# EAGLE schematic star (EAGLE 9.6.2)
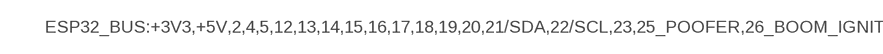
[diagram p0: schematic, sheet 1, part 1 of 2]
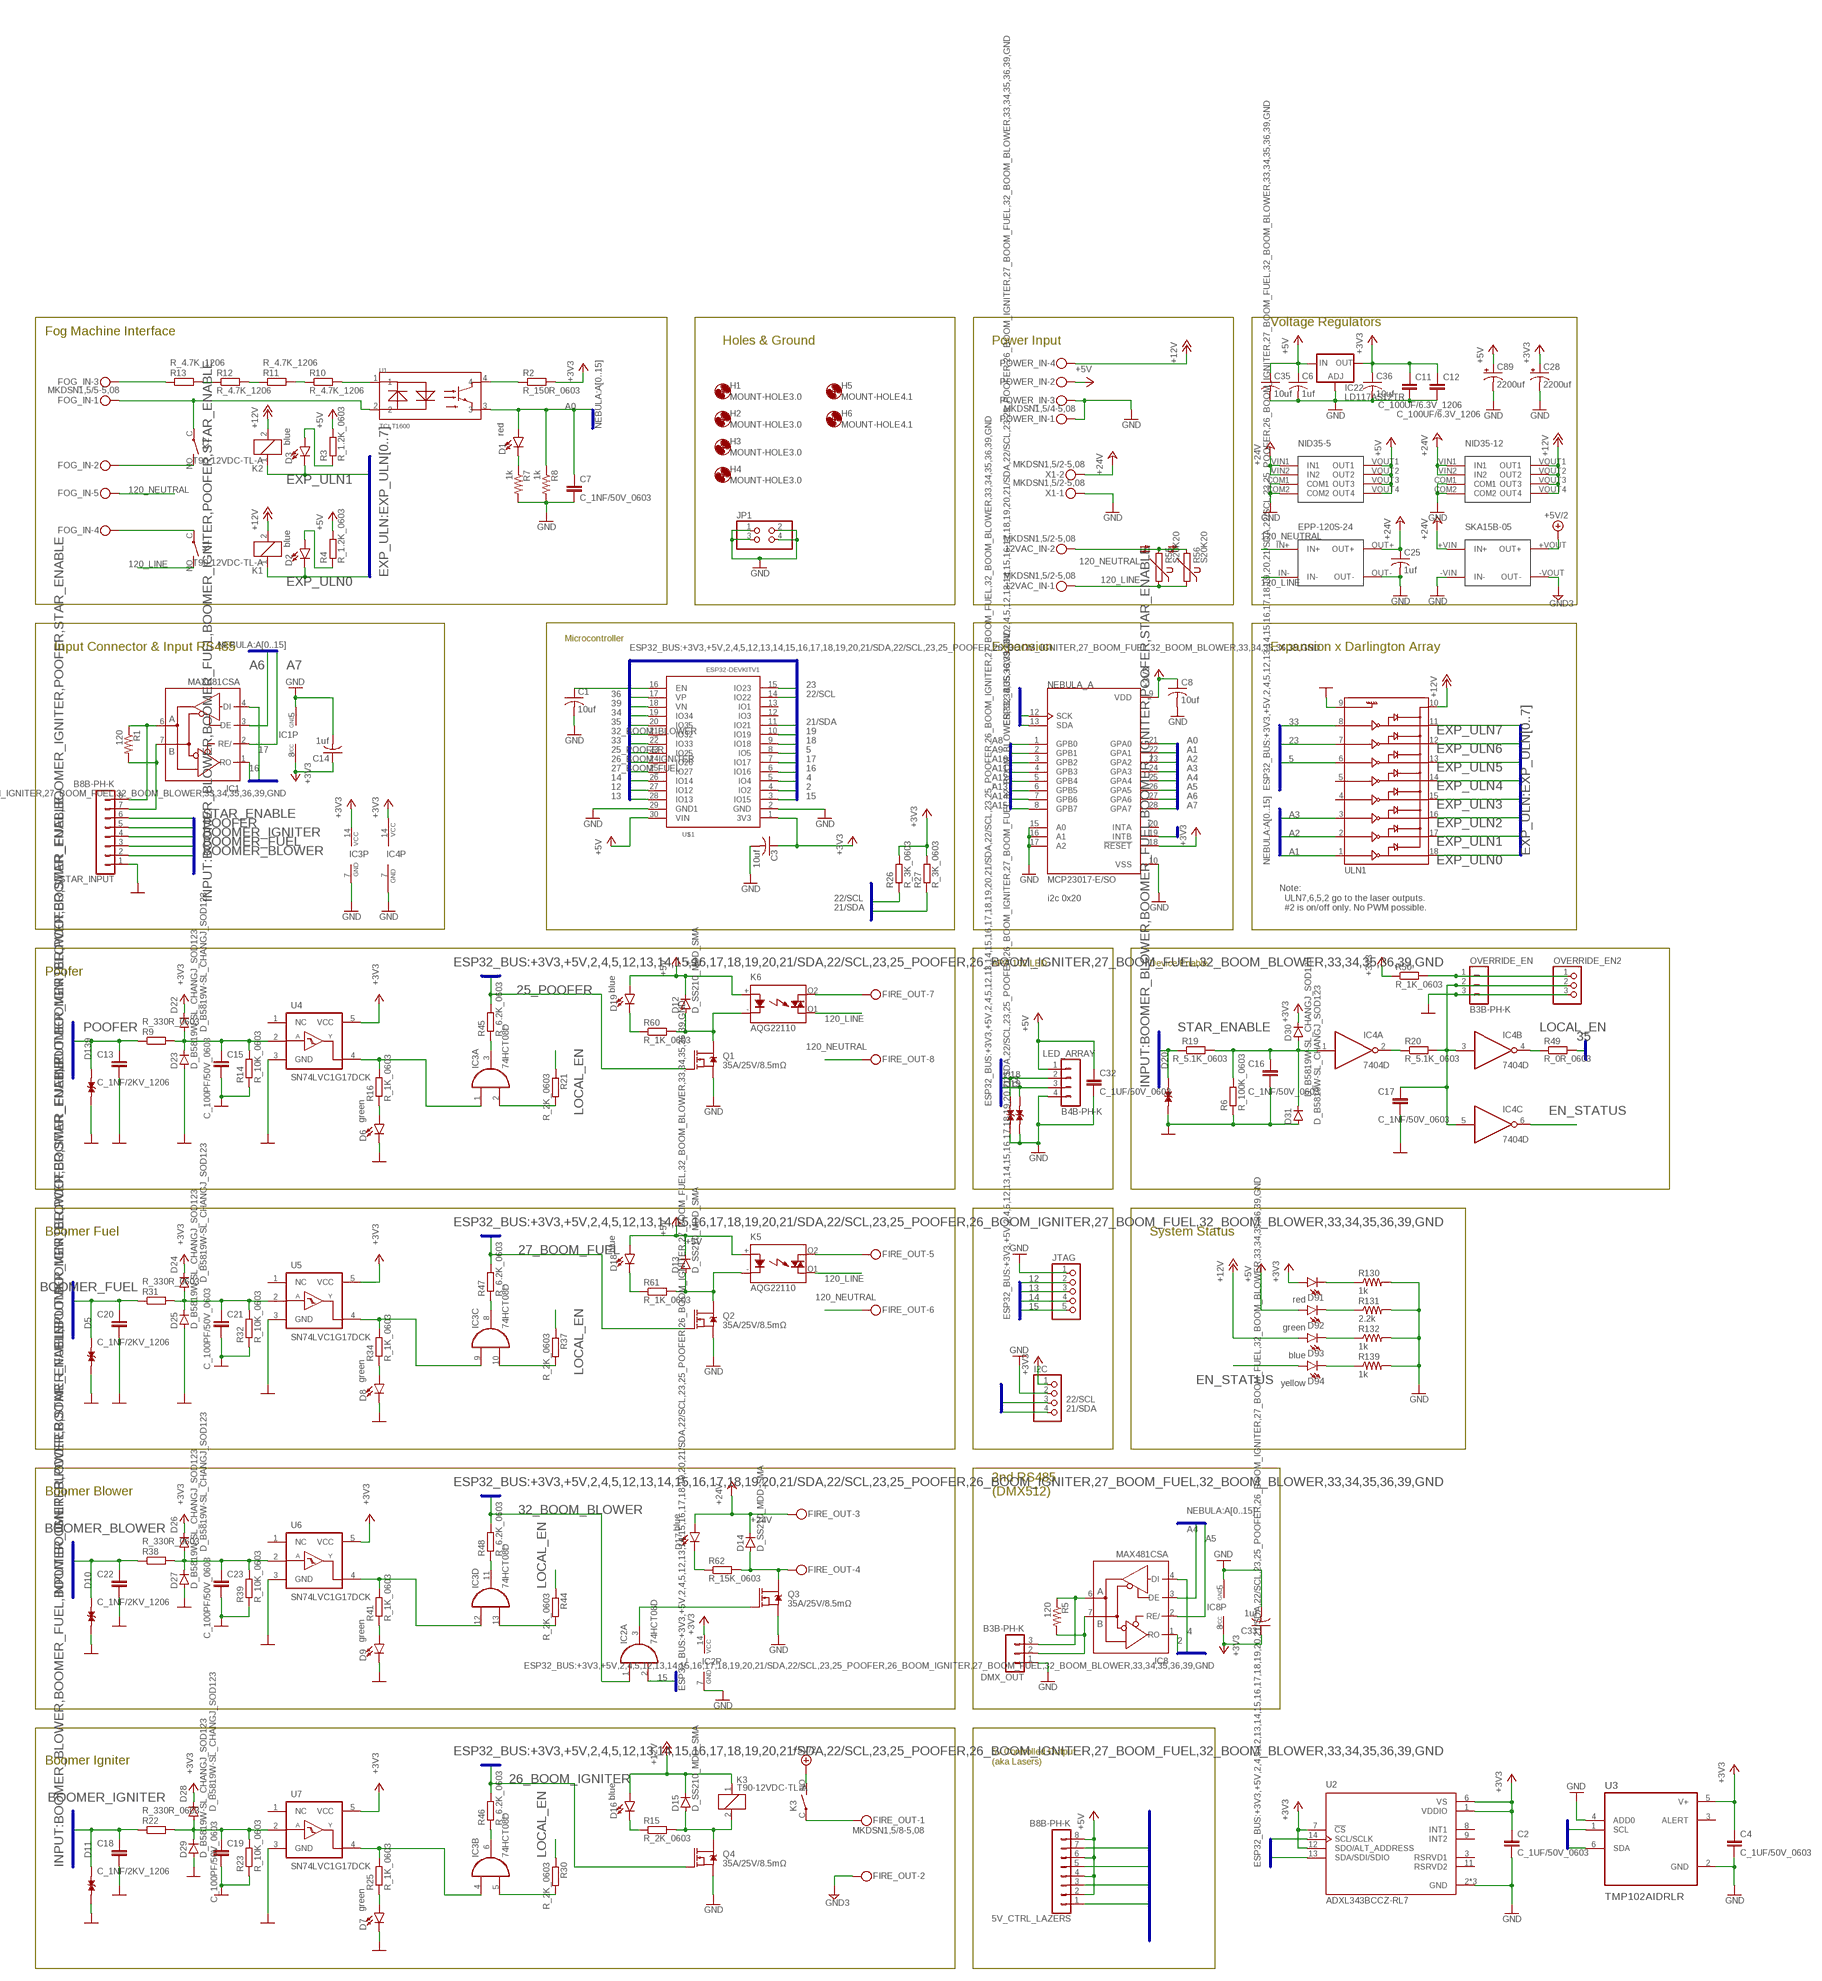
[diagram p1: schematic, sheet 1, part 2 of 2]

## Parts
5V_CTRL_LAZERS  B8B-PH-K  [B8B-PH-K]
12VAC_IN  MKDSN1,5/2-5,08  [MKDSN1,5/2-5,08]
C1  10uf  C-USC0603  [C0603]
C2  C_1UF/50V_0603  [C0603]
C3  10uf  C-USC0603  [C0603]
C4  C_1UF/50V_0603  [C0603]
C6  1uf  C-USC0805  [C0805]
C7  C_1NF/50V_0603  [C0603]
C8  10uf  C-USC0603  [C0603]
C11  C_100UF/6.3V_1206  [C1206]
C12  C_100UF/6.3V_1206  [C1206]
C13  C_1NF/2KV_1206  [C1206]
C14  1uf  C-USC0805  [C0805]
C15  C_100PF/50V_0603  [C0603]
C16  C_1NF/50V_0603  [C0603]
C17  C_1NF/50V_0603  [C0603]
C18  C_1NF/2KV_1206  [C1206]
C19  C_100PF/50V_0603  [C0603]
C20  C_1NF/2KV_1206  [C1206]
C21  C_100PF/50V_0603  [C0603]
C22  C_1NF/2KV_1206  [C1206]
C23  C_100PF/50V_0603  [C0603]
C25  1uf  C-USC0805  [C0805]
C28  2200uf  CPOL-USE5-13  [E5-13]
C32  C_1UF/50V_0603  [C0603]
C33  1uf  C-USC0805  [C0805]
C35  10uf  C-USC0603  [C0603]
C36  10uf  C-USC0603  [C0603]
C89  2200uf  CPOL-USE5-13  [E5-13]
D1  red  LED0603  [LED-0603]
D2  blue  LED0603  [LED-0603]
D3  blue  LED0603  [LED-0603]
D4  SMBJ8.0CA  [DIOM4336X265N]
D5  SMBJ8.0CA  [DIOM4336X265N]
D6  green  LED0603  [LED-0603]
D7  green  LED0603  [LED-0603]
D8  green  LED0603  [LED-0603]
D9  green  LED0603  [LED-0603]
D10  SMBJ8.0CA  [DIOM4336X265N]
D11  SMBJ8.0CA  [DIOM4336X265N]
D12  D_SS210_MDD_SMA  [DO-214AC]
D13  D_SS210_MDD_SMA  [DO-214AC]
D14  D_SS210_MDD_SMA  [DO-214AC]
D15  D_SS210_MDD_SMA  [DO-214AC]
D16  blue  LED0603  [LED-0603]
D17  blue  LED0603  [LED-0603]
D18  blue  LED0603  [LED-0603]
D19  blue  LED0603  [LED-0603]
D20  SMBJ8.0CA  [DIOM4336X265N]
D21  SMBJ8.0CA  [DIOM4336X265N]
D22  D_B5819W-SL_CHANGJ_SOD123  [SOD123]
D23  D_B5819W-SL_CHANGJ_SOD123  [SOD123]
D24  D_B5819W-SL_CHANGJ_SOD123  [SOD123]
D25  D_B5819W-SL_CHANGJ_SOD123  [SOD123]
D26  D_B5819W-SL_CHANGJ_SOD123  [SOD123]
D27  D_B5819W-SL_CHANGJ_SOD123  [SOD123]
D28  D_B5819W-SL_CHANGJ_SOD123  [SOD123]
D29  D_B5819W-SL_CHANGJ_SOD123  [SOD123]
D30  D_B5819W-SL_CHANGJ_SOD123  [SOD123]
D31  D_B5819W-SL_CHANGJ_SOD123  [SOD123]
D91  red  LED0603  [LED-0603]
D92  green  LED0603  [LED-0603]
D93  blue  LED0603  [LED-0603]
D94  yellow  LED0603  [LED-0603]
D139  SMBJ8.0CA  [DIOM4336X265N]
DMX_OUT  B3B-PH-K  [B3B-PH-K]
EPP-120S-24  EPP-120S  [EPS-25]
FIRE_OUT  MKDSN1,5/8-5,08  [MKDSN1,5/8-5,08]
FOG_IN  MKDSN1,5/5-5,08  [MKDSN1,5/5-5,08]
H1  MOUNT-HOLE3.0  [3,0]
H2  MOUNT-HOLE3.0  [3,0]
H3  MOUNT-HOLE3.0  [3,0]
H4  MOUNT-HOLE3.0  [3,0]
H5  MOUNT-HOLE4.1  [4,1]
H6  MOUNT-HOLE4.1  [4,1]
I2C  PINHD-1X4  [1X04]
IC1  MAX481CSA  [SO08]
IC2  74HCT08D  [SO14]
IC3  74HCT08D  [SO14]
IC4  7404D  [SO14]
IC8  MAX481CSA  [SO08]
IC22  LD117AS12TR  [SOT223]
JP1  PINHD-2X2  [2X02]
JTAG  PINHD-1X5  [1X05]
K1  T90-12VDC-TL-A  JT1A-PCB-DC12V  [JT1A-PCB]
K2  T90-12VDC-TL-A  JT1A-PCB-DC12V  [JT1A-PCB]
K3  T90-12VDC-TL-A  JT1A-PCB-DC12V  [JT1A-PCB]
K5  AQG22110  [AQG]
K6  AQG22110  [AQG]
LED_ARRAY  B4B-PH-K  [B4B-PH-K]
NEBULA_A  MCP23017-E/SO  [SOIC127P1030X265-28N]
NID35-5  NID35  [NID35]
NID35-12  NID35  [NID35]
OVERRIDE_EN  B3B-PH-K  [B3B-PH-K]
OVERRIDE_EN2  PINHD-1X3  [1X03]
POWER_IN  MKDSN1,5/4-5,08  [MKDSN1,5/4-5,08]
Q1  35A/25V/8.5mΩ  MOSFET-NCH-FDD8780  [DPAK]
Q2  35A/25V/8.5mΩ  MOSFET-NCH-FDD8780  [DPAK]
Q3  35A/25V/8.5mΩ  MOSFET-NCH-FDD8780  [DPAK]
Q4  35A/25V/8.5mΩ  MOSFET-NCH-FDD8780  [DPAK]
R1  120  R-US_R0603  [R0603]
R2  R_150R_0603  [R0603]
R3  R_1.2K_0603  [R0603]
R4  R_1.2K_0603  [R0603]
R5  120  R-US_R0603  [R0603]
R6  R_100K_0603  [R0603]
R7  1k  R-US_R0603  [R0603]
R8  1k  R-US_R0603  [R0603]
R9  R_330R_0603  [R0603]
R10  R_4.7K_1206  [R1206]
R11  R_4.7K_1206  [R1206]
R12  R_4.7K_1206  [R1206]
R13  R_4.7K_1206  [R1206]
R14  R_10K_0603  [R0603]
R15  R_2K_0603  [R0603]
R16  R_1K_0603  [R0603]
R19  R_5.1K_0603  [R0603]
R20  R_5.1K_0603  [R0603]
R21  R_2K_0603  [R0603]
R22  R_330R_0603  [R0603]
R23  R_10K_0603  [R0603]
R25  R_1K_0603  [R0603]
R26  R_3K_0603  [R0603]
R27  R_3K_0603  [R0603]
R30  R_2K_0603  [R0603]
R31  R_330R_0603  [R0603]
R32  R_10K_0603  [R0603]
R34  R_1K_0603  [R0603]
R37  R_2K_0603  [R0603]
R38  R_330R_0603  [R0603]
R39  R_10K_0603  [R0603]
R41  R_1K_0603  [R0603]
R44  R_2K_0603  [R0603]
R45  R_6.2K_0603  [R0603]
R46  R_6.2K_0603  [R0603]
R47  R_6.2K_0603  [R0603]
R48  R_6.2K_0603  [R0603]
R49  R_0R_0603  [R0603]
R50  R_1K_0603  [R0603]
R55  S20K20  [S20K20]
R56  S20K20  [S20K20]
R60  R_1K_0603  [R0603]
R61  R_1K_0603  [R0603]
R62  R_15K_0603  [R0603]
R130  1k  R-US_R0603  [R0603]
R131  2.2k  R-US_R0603  [R0603]
R132  1k  R-US_R0603  [R0603]
R139  1k  R-US_R0603  [R0603]
SKA15B-05  SKA15B  [SKA15B]
STAR_INPUT  B8B-PH-K  [B8B-PH-K]
U1  TCLT1600  [SOP254P1015X230-4N]
U2  ADXL343BCCZ-RL7  [PQFN80P300X500X100-14N]
U3  TMP102AIDRLR  [SOT50P160X60-6N]
U4  SN74LVC1G17DCK  [SC70-5]
U5  SN74LVC1G17DCK  [SC70-5]
U6  SN74LVC1G17DCK  [SC70-5]
U7  SN74LVC1G17DCK  [SC70-5]
U$1  ESP32DEVKITV1  [ESP32-DEVKITV1]
ULN1  ULN2803SOICW  [SO18L]
X1  MKDSN1,5/2-5,08  [MKDSN1,5/2-5,08]

## Nets
2: IC8.1(RO) U$1.4(IO2)
4: IC8.4(DI) U$1.5(IO4)
5: U$1.8(IO5) ULN1.6
12: JTAG.2 U$1.27(IO12)
13 [3V3]: JTAG.3 U$1.28(IO13)
14: JTAG.4 U$1.26(IO14)
15: IC2.2(A:I1) JTAG.5 U$1.3(IO15)
16: IC1.1(RO) U$1.6(IO16)
17: IC1.4(DI) U$1.7(IO17)
18: D21.2 LED_ARRAY.2 U$1.9(IO18)
19: D4.2 LED_ARRAY.3 U$1.10(IO19)
21/SDA: I2C.4 NEBULA_A.13(SDA) R27.1 U2.13(SDA/SDI/SDIO) U3.6(SDA) U$1.11(IO21)
22/SCL: I2C.3 NEBULA_A.12(SCK) R26.1 U2.14(SCL/SCLK) U3.1(SCL) U$1.14(IO22)
23: U$1.15(IO23) ULN1.7
25_POOFER: Q1.1(G) R45.2 U$1.23(IO25)
26_BOOM_IGNITER: Q4.1(G) R46.2 U$1.24(IO26)
27_BOOM_FUEL: Q2.1(G) R47.2 U$1.25(IO27)
32_BOOM_BLOWER: IC2.1(A:I0) R48.2 U$1.21(IO32)
33: U$1.22(IO33) ULN1.8
34: NEBULA_A.19(INTB) U$1.19(IO34)
35: R49.2 U$1.20(IO35)
36: U$1.17(VP)
39: U$1.18(VN)
120_LINE [120VAC_PWR]: 12VAC_IN.1 EPP-120S-24.IN- K1.NO(S) K5.O1(DS2) K6.O1(DS2) R55.1 R56.1
120_NEUTRAL [120VAC_PWR]: 12VAC_IN.2 EPP-120S-24.IN+ FIRE_OUT.6 FIRE_OUT.8 FOG_IN.5 R55.2 R56.2
+3V3 [3V3]: C2.1 C3.1 C4.1 C8.1 C11.1 C12.1 C14.1 C28.+ C33.1 C36.1 D22.C D24.C D26.C D28.C D30.C D91.A I2C.1 IC1.8(VCC) IC2.14(P:VCC) IC3.14(P:VCC) IC4.14(P:VCC) IC8.8(VCC) IC22.4(OUT) NEBULA_A.9(VDD) NEBULA_A.18(!RESET) R2.2 R26.2 R27.2 R50.1 U2.1(VDDIO) U2.6(VS) U2.7(!CS) U2.12(SDO/ALT_ADDRESS) U3.5(V+) U4.5(VCC) U5.5(VCC) U6.5(VCC) U7.5(VCC) U$1.1(3V3)
+5V [5V]: 5V_CTRL_LAZERS.2 5V_CTRL_LAZERS.4 5V_CTRL_LAZERS.6 5V_CTRL_LAZERS.8 C6.1 C32.1 C35.1 C89.+ D12.C D13.C D18.A D19.A D92.A IC22.3(IN) K5.+(A) K6.+(A) LED_ARRAY.1 NID35-5.VOUT1(OUT1) NID35-5.VOUT2(OUT2) NID35-5.VOUT3(OUT3) NID35-5.VOUT4(OUT4) POWER_IN.2 R3.2 R4.2 U$1.30(VIN)
+5V/2: K3.NO(S) SKA15B-05.+VOUT(OUT+)
+12V [12V]: D15.C D16.A D93.A K1.2 K2.2 K3.1 NID35-12.VOUT1(OUT1) NID35-12.VOUT2(OUT2) NID35-12.VOUT3(OUT3) NID35-12.VOUT4(OUT4) POWER_IN.4 ULN1.10
+24V: C25.1 D14.C D17.A EPP-120S-24.OUT+ FIRE_OUT.3 NID35-5.VIN1(IN1) NID35-5.VIN2(IN2) NID35-12.VIN1(IN1) NID35-12.VIN2(IN2) SKA15B-05.+VIN(IN+) X1.2
A0: C7.1 D1.A NEBULA_A.21(GPA0) R8.1 U1.3
A1: NEBULA_A.22(GPA1) ULN1.1
A2: NEBULA_A.23(GPA2) ULN1.2
A3: NEBULA_A.24(GPA3) ULN1.3
A4: IC8.3(DE) NEBULA_A.25(GPA4)
A5: IC8.2(RE/) NEBULA_A.26(GPA5)
A6: IC1.3(DE) NEBULA_A.27(GPA6)
A7: IC1.2(RE/) NEBULA_A.28(GPA7)
A8: NEBULA_A.1(GPB0)
A9: NEBULA_A.2(GPB1)
A10: NEBULA_A.3(GPB2)
A11: NEBULA_A.4(GPB3)
A12: NEBULA_A.5(GPB4)
A13: NEBULA_A.6(GPB5)
A14: NEBULA_A.7(GPB6)
A15: NEBULA_A.8(GPB7)
BOOMER_BLOWER: C22.1 D10.2 R38.1 STAR_INPUT.2
BOOMER_FUEL: C20.1 D5.2 R31.1 STAR_INPUT.3
BOOMER_IGNITER: C18.1 D11.2 R22.1 STAR_INPUT.4
EN_STATUS: D94.A IC4.6(C:O)
EXP_ULN0: D2.C K1.1 ULN1.18
EXP_ULN1: D3.C K2.1 ULN1.17
EXP_ULN2: 5V_CTRL_LAZERS.7 ULN1.16
EXP_ULN3: ULN1.15
EXP_ULN4: ULN1.14
EXP_ULN5: 5V_CTRL_LAZERS.5 ULN1.13
EXP_ULN6: 5V_CTRL_LAZERS.3 ULN1.12
EXP_ULN7: 5V_CTRL_LAZERS.1 ULN1.11
GND [GND]: C1.2 C2.2 C3.2 C4.2 C6.2 C7.2 C8.2 C11.2 C12.2 C13.2 C14.2 C15.2 C16.2 C17.2 C18.2 C19.2 C20.2 C21.2 C22.2 C23.2 C25.2 C28.- C32.2 C33.2 C35.2 C36.2 C89.- D4.1 D5.1 D6.C D7.C D8.C D9.C D10.1 D11.1 D20.1 D21.1 D23.A D25.A D27.A D29.A D31.A D139.1 DMX_OUT.1 EPP-120S-24.OUT- I2C.2 IC1.5(GND) IC2.7(P:GND) IC3.7(P:GND) IC4.7(P:GND) IC8.5(GND) IC22.1(ADJ) JP1.1 JP1.2 JP1.3 JP1.4 JTAG.1 LED_ARRAY.4 NEBULA_A.10(VSS) NEBULA_A.15(A0) NEBULA_A.16(A1) NEBULA_A.17(A2) NID35-5.COM1 NID35-5.COM2 NID35-12.COM1 NID35-12.COM2 OVERRIDE_EN2.3 OVERRIDE_EN.3 POWER_IN.1 POWER_IN.3 Q1.3(S) Q2.3(S) Q3.3(S) Q4.3(S) R6.1 R7.2 R8.2 R14.1 R23.1 R32.1 R39.1 R130.2 R131.2 R132.2 R139.2 SKA15B-05.-VIN(IN-) STAR_INPUT.1 U2.2(GND) U2.4(GND) U2.5(GND) U3.2(GND) U3.4(ADD0) U4.3(GND) U5.3(GND) U6.3(GND) U7.3(GND) U$1.2(GND) U$1.29(GND1) ULN1.9 X1.1
GND3 [GND]: FIRE_OUT.2 SKA15B-05.-VOUT(OUT-)
LOCAL_EN: IC4.4(B:O) R21.1 R30.1 R37.1 R44.1 R49.1
N$1: C1.1 U$1.16(EN)
N$2: R2.1 U1.4
N$3: D2.A R4.1
N$4: D3.A R3.1
N$5: DMX_OUT.2 IC8.7(B) R5.2
N$6: DMX_OUT.3 IC8.6(A) R5.1
N$7 [120VAC]: FOG_IN.3 R13.1
N$8 [120VAC]: R12.1 R13.2
N$9 [120VAC]: R11.1 R12.2
N$10 [120VAC]: R10.1 R11.2
N$11 [120VAC]: R10.2 U1.1
N$12: D1.C R7.1
N$13 [120VAC]: FOG_IN.2 K2.NO(S)
N$14 [120VAC_PWR]: FOG_IN.4 K1.C(P)
N$15 [120VAC]: FOG_IN.1 K2.C(P) U1.2
N$16: IC3.1(A:I0) R16.2 U4.4(Y)
N$17: C15.1 D22.A D23.C R9.2 R14.2 U4.2(A)
N$18: D6.A R16.1
N$21: IC4.2(A:O) R20.1
N$22: C17.1 IC4.3(B:I) IC4.5(C:I) OVERRIDE_EN2.2 OVERRIDE_EN.2 R20.2
N$23: C16.1 D30.A D31.C IC4.1(A:I) R6.2 R19.2
N$24: IC3.2(A:I1) R21.2
N$25: C19.1 D28.A D29.C R22.2 R23.2 U7.2(A)
N$26: IC3.4(B:I0) R25.2 U7.4(Y)
N$27: D7.A R25.1
N$30: IC3.5(B:I1) R30.2
N$31: C21.1 D24.A D25.C R31.2 R32.2 U5.2(A)
N$32: IC3.9(C:I0) R34.2 U5.4(Y)
N$33: D8.A R34.1
N$36: IC3.10(C:I1) R37.2
N$37: C23.1 D26.A D27.C R38.2 R39.2 U6.2(A)
N$38: IC3.12(D:I0) R41.2 U6.4(Y)
N$39: D9.A R41.1
N$42: IC3.13(D:I1) R44.2
N$43: IC3.3(A:O) R45.1
N$44: IC3.6(B:O) R46.1
N$45: IC3.8(C:O) R47.1
N$46: IC3.11(D:O) R48.1
N$47: D13.A K5.-(K) Q2.4(D) R61.2
N$48: FIRE_OUT.7 K6.O2(DS1)
N$49: D12.A K6.-(K) Q1.4(D) R60.2
N$50: FIRE_OUT.5 K5.O2(DS1)
N$51: D14.A FIRE_OUT.4 Q3.4(D) R62.2
N$52: D15.A K3.2 Q4.4(D) R15.2
N$53: FIRE_OUT.1 K3.C(P)
N$54: D16.C R15.1
N$55: D17.C R62.1
N$56: D18.C R61.1
N$57: D19.C R60.1
N$58: OVERRIDE_EN2.1 OVERRIDE_EN.1 R50.2
N$60: IC2.3(A:O) Q3.1(G)
N$108: IC1.7(B) R1.2 STAR_INPUT.7
N$109: IC1.6(A) R1.1 STAR_INPUT.8
N$156: D91.C R130.1
N$157: D92.C R131.1
N$158: D93.C R132.1
N$159: D94.C R139.1
POOFER: C13.1 D139.2 R9.1 STAR_INPUT.5
STAR_ENABLE: D20.2 R19.1 STAR_INPUT.6
Unconnected: IC2.4(B:I0) IC2.5(B:I1) IC2.6(B:O) IC2.8(C:O) IC2.9(C:I0) IC2.10(C:I1) IC2.11(D:O) IC2.12(D:I0) IC2.13(D:I1) IC4.8(D:O) IC4.9(D:I) IC4.10(E:O) IC4.11(E:I) IC4.12(F:O) IC4.13(F:I) NEBULA_A.20(INTA) U2.3(RSRVD1) U2.8(INT1) U2.9(INT2) U2.11(RSRVD2) U3.3(ALERT) U4.1(NC) U5.1(NC) U6.1(NC) U7.1(NC) U$1.12(IO3) U$1.13(IO1) ULN1.4 ULN1.5

## Buses
ESP32_BUS:+3V3,+5V,2,4,5,12,13,14,15,16,17,18,19,20,21/SDA,22/SCL,23,25_POOFER,26_BOOM_IGNITER,27_BOOM_FUEL,32_BOOM_BLOWER,33,34,35,36,39,GND
NEBULA:A[0..15]
EXP_ULN:EXP_ULN[0..7]
INPUT:BOOMER_BLOWER,BOOMER_FUEL,BOOMER_IGNITER,POOFER,STAR_ENABLE

## Notes on the sheet
- Voltage Regulators
- Fog Machine Interface
- Holes & Ground | Power Input
- Microcontroller
- Input Connector & Input RS485 | Expansion | Expansion x Darlington Array
- i2c 0x20
- Note:
    ULN7,6,5,2 go to the laser outputs.
    #2 is on/off only. No PWM possible.
- APA 102 LED | Device Enable
- Poofer
- Boomer Fuel | System Status
- Boomer Blower
- 2nd RS485
  (DMX512)
- Boomer Igniter
- 5v Controlled Output
  (aka Lasers)

## Library data of the parts
5V_CTRL_LAZERS STAR_INPUT = con-jst-ph:B8B-PH-K: HEADER
12VAC_IN X1 = con-phoenix-508-jm:MKDSN1,5/2-5,08: MKDSN 1,5/ 2-5,08 Printklemme Nennstrom: 13,5 A Nennspannung: 250 V Rastermaß: 5,08 mm Polzahl: 2 Anschlussart: Schraubanschluss Montage: Löten Anschlussrichtung Leiter/Platine: 0 ° Artikelnummer: 1729128 Source: http://eshop.phoenixcontact.com .. 1729128.pdf
C1 C3 C8 C35 C36 = rcl:C-US: CAPACITOR, American symbol; LCSC_PART: C19702; SPICEPREFIX: C
C2 C4 C32 = JLC PCB Basic Parts_loc:C_: Capacitor General purpose SMD Capacitor; LCSC_DATASHEET: https://datasheet.lcsc.com/lcsc/1810261812_Samsung-Electro-Mechanics-CL10A105KB8NNNC_C15849.pdf; LCSC_PART: C15849; LCSC_ROTATION_CCW: 0; LCSC_STOCK: 14650365; PROPERTIES: 50V 1uF X5R ±10% 0603 ROHS
C6 C14 C25 C33 = rcl:C-US: CAPACITOR, American symbol; LCSC_PART: C15849; SPICEPREFIX: C
C7 C16 C17 = JLC PCB Basic Parts_loc:C_: Capacitor General purpose SMD Capacitor; LCSC_DATASHEET: https://datasheet.lcsc.com/lcsc/1811071810_Samsung-Electro-Mechanics-CL10B102KB8NNNC_C1588.pdf; LCSC_PART: C1588; LCSC_ROTATION_CCW: 0; LCSC_STOCK: 2243141; PROPERTIES: 50V 1nF X7R ±10% 0603 ROHS
C11 C12 = JLC PCB Basic Parts_loc:C_: Capacitor General purpose SMD Capacitor; LCSC_DATASHEET: https://datasheet.lcsc.com/lcsc/1810301816_Samsung-Electro-Mechanics-CL31A107MQHNNNE_C15008.pdf; LCSC_PART: C15008; LCSC_ROTATION_CCW: 0; LCSC_STOCK: 547696; PROPERTIES: 6.3V 100uF X5R ±20% 1206 ROHS
C13 C18 C20 C22 = JLC PCB Basic Parts_loc:C_: Capacitor General purpose SMD Capacitor; LCSC_DATASHEET: https://datasheet.lcsc.com/lcsc/1810311314_FH-Guangdong-Fenghua-Advanced-Tech-1206B102K202NT_C9196.pdf; LCSC_PART: C9196; LCSC_ROTATION_CCW: 0; LCSC_STOCK: 8943689; PROPERTIES: 2kV 1nF X7R ±10% 1206 ROHS
C15 C19 C21 C23 = JLC PCB Basic Parts_loc:C_: Capacitor General purpose SMD Capacitor; LCSC_DATASHEET: https://datasheet.lcsc.com/lcsc/1811151136_Samsung-Electro-Mechanics-CL10C101JB8NNNC_C14858.pdf; LCSC_PART: C14858; LCSC_ROTATION_CCW: 0; LCSC_STOCK: 2152181; PROPERTIES: 50V 100pF C0G ±5% 0603 ROHS
C28 C89 = rcl:CPOL-US: POLARIZED CAPACITOR, American symbol; DIST: https://amzn.to/3iR84VS; SPICEPREFIX: C
D1 D91 = SparkFun-LED:LED: LED (Generic) Standard schematic elements and footprints for 5mm, 3mm, 1206, and 0603 sized LEDs. Generic LEDs with no color specified.; JLC_ROTATION: 180; LCSC_PART: C2286
D2 D3 D16-D19 D93 = SparkFun-LED:LED: LED (Generic) Standard schematic elements and footprints for 5mm, 3mm, 1206, and 0603 sized LEDs. Generic LEDs with no color specified.; JLC_ROTATION: 180; LCSC_PART: C72041
D4 D5 D10 D11 D20 D21 D139 = SMBJ8.0CA:SMBJ8.0CA: Check availability <https://pricing.snapeda.com/parts/SMBJ8.0CA/Littelfuse%20Inc./view-part?ref=eda>; AVAILABILITY: In Stock; DESCRIPTION: 600 Watt TVS 5.0v working, 9v clamp; LCSC_PART: C78757; MF: Littelfuse Inc.; MP: SMBJ8.0CA; PACKAGE: DO-214 Littelfuse Inc.; PRICE: None; PURCHASE-URL: https://pricing.snapeda.com/search/part/SMBJ8.0CA/?ref=eda
D6-D9 D92 = SparkFun-LED:LED: LED (Generic) Standard schematic elements and footprints for 5mm, 3mm, 1206, and 0603 sized LEDs. Generic LEDs with no color specified.; JLC_ROTATION: 180; LCSC_PART: C72043
D12-D15 = JLC PCB Basic Parts_loc:D_: Diode; LCSC_DATASHEET: https://datasheet.lcsc.com/lcsc/1811071613_MDD-Microdiode-Electronics--SS210_C14996.pdf; LCSC_PART: C14996; LCSC_ROTATION_CCW: 180; LCSC_STOCK: 307807; PROPERTIES: 100V 850mV@2A 2A SMA(DO-214AC) Schottky Barrier Diodes (SBD) ROHS
D22-D31 = JLC PCB Basic Parts_loc:D_: Diode; LCSC_DATASHEET: https://datasheet.lcsc.com/lcsc/1809140216_Changjiang-Electronics-Tech--CJ-B5819W-SL_C8598.pdf; LCSC_PART: C8598; LCSC_ROTATION_CCW: 180; LCSC_STOCK: 304161; PROPERTIES: 40V 600mV@1A 1A SOD-123 Schottky Barrier Diodes (SBD) ROHS
D94 = SparkFun-LED:LED: LED (Generic) Standard schematic elements and footprints for 5mm, 3mm, 1206, and 0603 sized LEDs. Generic LEDs with no color specified.; JLC_ROTATION: 180; LCSC_PART: C72038
DMX_OUT OVERRIDE_EN = con-jst-ph:B3B-PH-K: HEADER
EPP-120S-24 = Nova:EPP-120S
FIRE_OUT = con-phoenix-508-jm:MKDSN1,5/8-5,08: MKDSN 1,5/ 8-5,08 Printklemme Nennstrom: 13,5 A Nennspannung: 250 V Rastermaß: 5,08 mm Polzahl: 8 Anschlussart: Schraubanschluss Montage: Löten Anschlussrichtung Leiter/Platine: 0 ° Artikelnummer: 1729186 Source: http://eshop.phoenixcontact.com .. 1729186.pdf
FOG_IN = con-phoenix-508-jm:MKDSN1,5/5-5,08: MKDSN 1,5/ 5-5,08 Printklemme Nennstrom: 13,5 A Nennspannung: 250 V Rastermaß: 5,08 mm Polzahl: 5 Anschlussart: Schraubanschluss Montage: Löten Anschlussrichtung Leiter/Platine: 0 ° Artikelnummer: 1729157 Source: http://eshop.phoenixcontact.com .. 1729157.pdf
H1-H6 = holes:MOUNT-HOLE: MOUNTING HOLE with drill center marker
I2C = pinhead:PINHD-1X4: PIN HEADER
IC1 IC8 = maxim:MAX481CSA: RS485 TRANSEIVER; LCSC_PART: C8963; MF: MAXIM; MPN: MAX481CSA; OC_FARNELL: unknown; OC_NEWARK: 90C3817
IC2 IC3 = 74xx-eu:74*08: Quad 2-input AND gate; LCSC_PART: C5593
IC4 = 74xx-us:74*04: Hex INVERTER; LCSC_PART: C5590
IC22 = v-reg:LD117A?*: Low drop fixed and adjustable positive voltage regulators 1 A Source: http://www.st.com/stonline/products/literature/ds/7194/ld1117axx.pdf; LCSC_PART: C347222; PRICE: 0.5
JP1 = pinhead:PINHD-2X2: PIN HEADER
JTAG = pinhead:PINHD-1X5: PIN HEADER
K1-K3 = relay:JT1A?-*: COMPACT ECONOMICAL 30 AMP. RELAY NAiS Source: http://www.mew-europe.com/.. en_ds_61212_0000.pdf; OC_FARNELL: unknown; OC_NEWARK: unknown
K5 K6 = relay:AQG*: SOLID STATE RELAY NAiS Zero-cross, Non zero-cross Source: http://www.mew-europe.com/.. en_ds_61611_0000.pdf; OC_FARNELL: unknown; OC_NEWARK: unknown
LED_ARRAY = con-jst-ph:B4B-PH-K: HEADER
NEBULA_A = MCP23017-E_SO:MCP23017-E/SO: MCP23017 Series 5.5 V 1.7 MHz SMT 16-Bit I2C I/O Expander - SOIC-28 Check availability <https://pricing.snapeda.com/parts/MCP23017-E/SO/Microchip/view-part?ref=eda>; AVAILABILITY: In Stock; DESCRIPTION: I/O Expander 16 I²C 1.7 MHz 28-SOIC; LCSC_PART: C629440; MF: Microchip; MP: MCP23017-E/SO; PACKAGE: SOIC-28 Microchip; PRICE: None; PURCHASE-URL: https://pricing.snapeda.com/search/part/MCP23017-E/SO/?ref=eda
NID35-5 NID35-12 = Nova:NID35
OVERRIDE_EN2 = pinhead:PINHD-1X3: PIN HEADER
POWER_IN = con-phoenix-508-jm:MKDSN1,5/4-5,08: MKDSN 1,5/ 4-5,08 Printklemme Nennstrom: 13,5 A Nennspannung: 250 V Rastermaß: 5,08 mm Polzahl: 4 Anschlussart: Schraubanschluss Montage: Löten Anschlussrichtung Leiter/Platine: 0 ° Artikelnummer: 1729144 Source: http://eshop.phoenixcontact.com .. 1729144.pdf
Q1-Q4 = SparkFun-DiscreteSemi:MOSFET-NCH: N-channel MOSFETs Voltage controlled devices that allow control of high current outputs. SparkFun Products: SparkFun OpenScale <https://www.sparkfun.com/products/13261> SparkFun Digital Sandbox <https://www.sparkfun.com/products/12651> SparkFun Monster Moto Shield <https://www.sparkfun.com/products/10182> SparkFun MOSFET Power Controller <https://www.sparkfun.com/products/11214>; LCSC_PART: C2995335; PROD_ID: TRANS-09984
R1 R5 = rcl:R-US_: RESISTOR, American symbol; LCSC_PART: C22787; SPICEPREFIX: R
R2 = JLC PCB Basic Parts_loc:R_: Resistor General purpose SMD Resistor; LCSC_DATASHEET: https://datasheet.lcsc.com/lcsc/2110252030_UNI-ROYAL-Uniroyal-Elec-0603WAF1500T5E_C22808.pdf; LCSC_PART: C22808; LCSC_ROTATION_CCW: 0; LCSC_STOCK: 466893; PROPERTIES: ±1% 1/10W Thick Film Resistors 75V ±100ppm -55°C~+155°C 150Ohm 0603 ROHS
R3 R4 = JLC PCB Basic Parts_loc:R_: Resistor General purpose SMD Resistor; LCSC_DATASHEET: https://datasheet.lcsc.com/lcsc/2110252030_UNI-ROYAL-Uniroyal-Elec-0603WAF1201T5E_C22765.pdf; LCSC_PART: C22765; LCSC_ROTATION_CCW: 0; LCSC_STOCK: 476320; PROPERTIES: ±1% 1/10W Thick Film Resistors 75V ±100ppm -55°C~+155°C 1.2kOhm 0603 ROHS
R6 = JLC PCB Basic Parts_loc:R_: Resistor General purpose SMD Resistor; LCSC_DATASHEET: https://datasheet.lcsc.com/lcsc/2110260030_UNI-ROYAL-Uniroyal-Elec-0603WAF1003T5E_C25803.pdf; LCSC_PART: C25803; LCSC_ROTATION_CCW: 0; LCSC_STOCK: 5826279; PROPERTIES: ±1% 1/10W Thick Film Resistors 75V ±100ppm -55°C~+155°C 100kOhm 0603 ROHS
R7 R8 R130 R132 R139 = rcl:R-US_: RESISTOR, American symbol; LCSC_PART: C21190; SPICEPREFIX: R
R9 R22 R31 R38 = JLC PCB Basic Parts_loc:R_: Resistor General purpose SMD Resistor; LCSC_DATASHEET: https://datasheet.lcsc.com/lcsc/2110252130_UNI-ROYAL-Uniroyal-Elec-0603WAF3300T5E_C23138.pdf; LCSC_PART: C23138; LCSC_ROTATION_CCW: 0; LCSC_STOCK: 862746; PROPERTIES: ±1% 1/10W Thick Film Resistors 75V ±100ppm -55°C~+155°C 330Ohm 0603 ROHS
R10-R13 = JLC PCB Basic Parts_loc:R_: Resistor General purpose SMD Resistor; LCSC_DATASHEET: https://datasheet.lcsc.com/lcsc/2110251930_UNI-ROYAL-Uniroyal-Elec-1206W4F4701T5E_C17936.pdf; LCSC_PART: C17936; LCSC_ROTATION_CCW: 0; LCSC_STOCK: 161665; PROPERTIES: ±1% 250mW Thick Film Resistors 200V ±100ppm -55°C~+155°C 4.7kOhm 1206 ROHS
R14 R23 R32 R39 = JLC PCB Basic Parts_loc:R_: Resistor General purpose SMD Resistor; LCSC_DATASHEET: https://datasheet.lcsc.com/lcsc/2110260030_UNI-ROYAL-Uniroyal-Elec-0603WAF1002T5E_C25804.pdf; LCSC_PART: C25804; LCSC_ROTATION_CCW: 0; LCSC_STOCK: 7979018; PROPERTIES: ±1% 1/10W Thick Film Resistors 75V ±100ppm -55°C~+155°C 10kOhm 0603 ROHS
R15 R21 R30 R37 R44 = JLC PCB Basic Parts_loc:R_: Resistor General purpose SMD Resistor; LCSC_DATASHEET: https://datasheet.lcsc.com/lcsc/2110252130_UNI-ROYAL-Uniroyal-Elec-0603WAF2001T5E_C22975.pdf; LCSC_PART: C22975; LCSC_ROTATION_CCW: 0; LCSC_STOCK: 3372290; PROPERTIES: ±1% 1/10W Thick Film Resistors 75V ±100ppm -55°C~+155°C 2kOhm 0603 ROHS
R16 R25 R34 R41 R50 R60 R61 = JLC PCB Basic Parts_loc:R_: Resistor General purpose SMD Resistor; LCSC_DATASHEET: https://datasheet.lcsc.com/lcsc/2110252030_UNI-ROYAL-Uniroyal-Elec-0603WAF1001T5E_C21190.pdf; LCSC_PART: C21190; LCSC_ROTATION_CCW: 0; LCSC_STOCK: 5175299; PROPERTIES: ±1% 1/10W Thick Film Resistors 75V ±100ppm -55°C~+155°C 1kOhm 0603 ROHS
R19 R20 = JLC PCB Basic Parts_loc:R_: Resistor General purpose SMD Resistor; LCSC_DATASHEET: https://datasheet.lcsc.com/lcsc/2110252130_UNI-ROYAL-Uniroyal-Elec-0603WAF5101T5E_C23186.pdf; LCSC_PART: C23186; LCSC_ROTATION_CCW: 0; LCSC_STOCK: 2912883; PROPERTIES: ±1% 1/10W Thick Film Resistors 75V ±100ppm -55°C~+155°C 5.1kOhm 0603 ROHS
R26 R27 = JLC PCB Basic Parts_loc:R_: Resistor General purpose SMD Resistor; LCSC_DATASHEET: https://datasheet.lcsc.com/lcsc/2110251730_UNI-ROYAL-Uniroyal-Elec-0603WAF3001T5E_C4211.pdf; LCSC_PART: C4211; LCSC_ROTATION_CCW: 0; LCSC_STOCK: 740793; PROPERTIES: ±1% 1/10W Thick Film Resistors 75V ±100ppm -55°C~+155°C 3kOhm 0603 ROHS
R45-R48 = JLC PCB Basic Parts_loc:R_: Resistor General purpose SMD Resistor; LCSC_DATASHEET: https://datasheet.lcsc.com/lcsc/2110251730_UNI-ROYAL-Uniroyal-Elec-0603WAF6201T5E_C4260.pdf; LCSC_PART: C4260; LCSC_ROTATION_CCW: 0; LCSC_STOCK: 176806; PROPERTIES: ±1% 1/10W Thick Film Resistors 75V ±100ppm -55°C~+155°C 6.2kOhm 0603 ROHS
R49 = JLC PCB Basic Parts_loc:R_: Resistor General purpose SMD Resistor; LCSC_DATASHEET: https://datasheet.lcsc.com/lcsc/2110252030_UNI-ROYAL-Uniroyal-Elec-0603WAF0000T5E_C21189.pdf; LCSC_PART: C21189; LCSC_ROTATION_CCW: 0; LCSC_STOCK: 891306; PROPERTIES: ±1% 1/10W Thick Film Resistors 75V -55°C~+155°C 0Ohm 0603 ROHS
R55 R56 = varistor:S20K20: VARISTOR
R62 = JLC PCB Basic Parts_loc:R_: Resistor General purpose SMD Resistor; LCSC_DATASHEET: https://datasheet.lcsc.com/lcsc/2110252030_UNI-ROYAL-Uniroyal-Elec-0603WAF1502T5E_C22809.pdf; LCSC_PART: C22809; LCSC_ROTATION_CCW: 0; LCSC_STOCK: 394790; PROPERTIES: ±1% 1/10W Thick Film Resistors 75V ±100ppm -55°C~+155°C 15kOhm 0603 ROHS
R131 = rcl:R-US_: RESISTOR, American symbol; LCSC_PART: C4190; SPICEPREFIX: R
SKA15B-05 = Nova:SKA15B
U1 = TCLT1600:TCLT1600: TCLT1600 Series Single Channel 5000 Vrms Phototransistor Optocoupler - SOP-4L Check availability <https://pricing.snapeda.com/parts/TCLT1600/Vishay%20Semiconductor/view-part?ref=eda>; AVAILABILITY: In Stock; DESCRIPTION: Optoisolator Transistor Output 5000Vrms 1 Channel 4-SOP (2.54mm); LCSC_PART: C553998; MF: Vishay Semiconductor; MP: TCLT1600; PACKAGE: LSOP-4 Vishay; PRICE: None; PURCHASE-URL: https://pricing.snapeda.com/search/part/TCLT1600/?ref=eda
U2 = ADXL343BCCZ-RL7:ADXL343BCCZ-RL7: Accelerometer Triple ±2/±4/±8/±16g 2V to 3.6V 14-Pin LGA T/R Check availability <https://pricing.snapeda.com/parts/ADXL343BCCZ-RL7/Analog%20Devices/view-part?ref=eda>; AVAILABILITY: In Stock; DESCRIPTION: 3-Axis, ±2 g/±4 g/±8 g/±16 g Digital Accelerometer; LCSC_PART: C9667; MF: Analog Devices; MP: ADXL343BCCZ-RL7; PACKAGE: LGA -14 Analog Devices; PRICE: None; PURCHASE-URL: https://pricing.snapeda.com/search/part/ADXL343BCCZ-RL7/?ref=eda
U3 = TMP102AIDRLR:TMP102AIDRLR: Check availability <https://pricing.snapeda.com/parts/TMP102AIDRLR/Texas%20Instruments/view-part?ref=eda>; AVAILABILITY: In Stock; DESCRIPTION: 2C digital temperature sensor, I2C/SMBus in 2.56mm2 package; MF: Texas Instruments; MP: TMP102AIDRLR; PACKAGE: SOT-5X3-6 Texas Instruments; PRICE: None; PURCHASE-URL: https://pricing.snapeda.com/search/part/TMP102AIDRLR/?ref=eda
U4-U7 = SN74LVC1G17:SN74LVC1G17: SINGLE SCHMITT-TRIGGER BUFFER Check availability <https://pricing.snapeda.com/parts/SN74LVC1G17/Texas%20Instruments/view-part?ref=eda>; AVAILABILITY: In Stock; DESCRIPTION: Buffer, Non-Inverting 1 Element 1 Bit per Element Push-Pull Output SOT-23-5; MF: Texas Instruments; MP: SN74LVC1G17; PACKAGE: SOT-23 Texas Instruments; PRICE: None; PURCHASE-URL: https://pricing.snapeda.com/search/part/SN74LVC1G17/?ref=eda
U$1 = ESP32-DEVKITV1:ESP32DEVKITV1
ULN1 = SparkFun-IC-Special-Function:ULN2803: Darlington Driver(IC-07959, low stock) ULN2803 Darlington array. 500mA max per channel, 8-channel package. Spark Fun Electronics SKU : COM-00312; LCSC_PART: C9683

## Net classes
0 default: width 0.305 mm, clearance 0.203 mm
1 GND: width 0.305 mm, clearance 0.254 mm
2 12V: width 1.27 mm, clearance 0.254 mm
3 5V: width 0.508 mm, clearance 0.254 mm
4 3V3: width 0.305 mm, clearance 0.254 mm
5 12V_FUSED: width 0.635 mm, clearance 0.254 mm
6 120VAC_PWR: width 1.27 mm, clearance 0.508 mm
7 120VAC: width 1.27 mm, clearance 0.508 mm
8 60V: width 1.27 mm, clearance 0.508 mm